# EAGLE design 1-B (EAGLE 9.6.0)
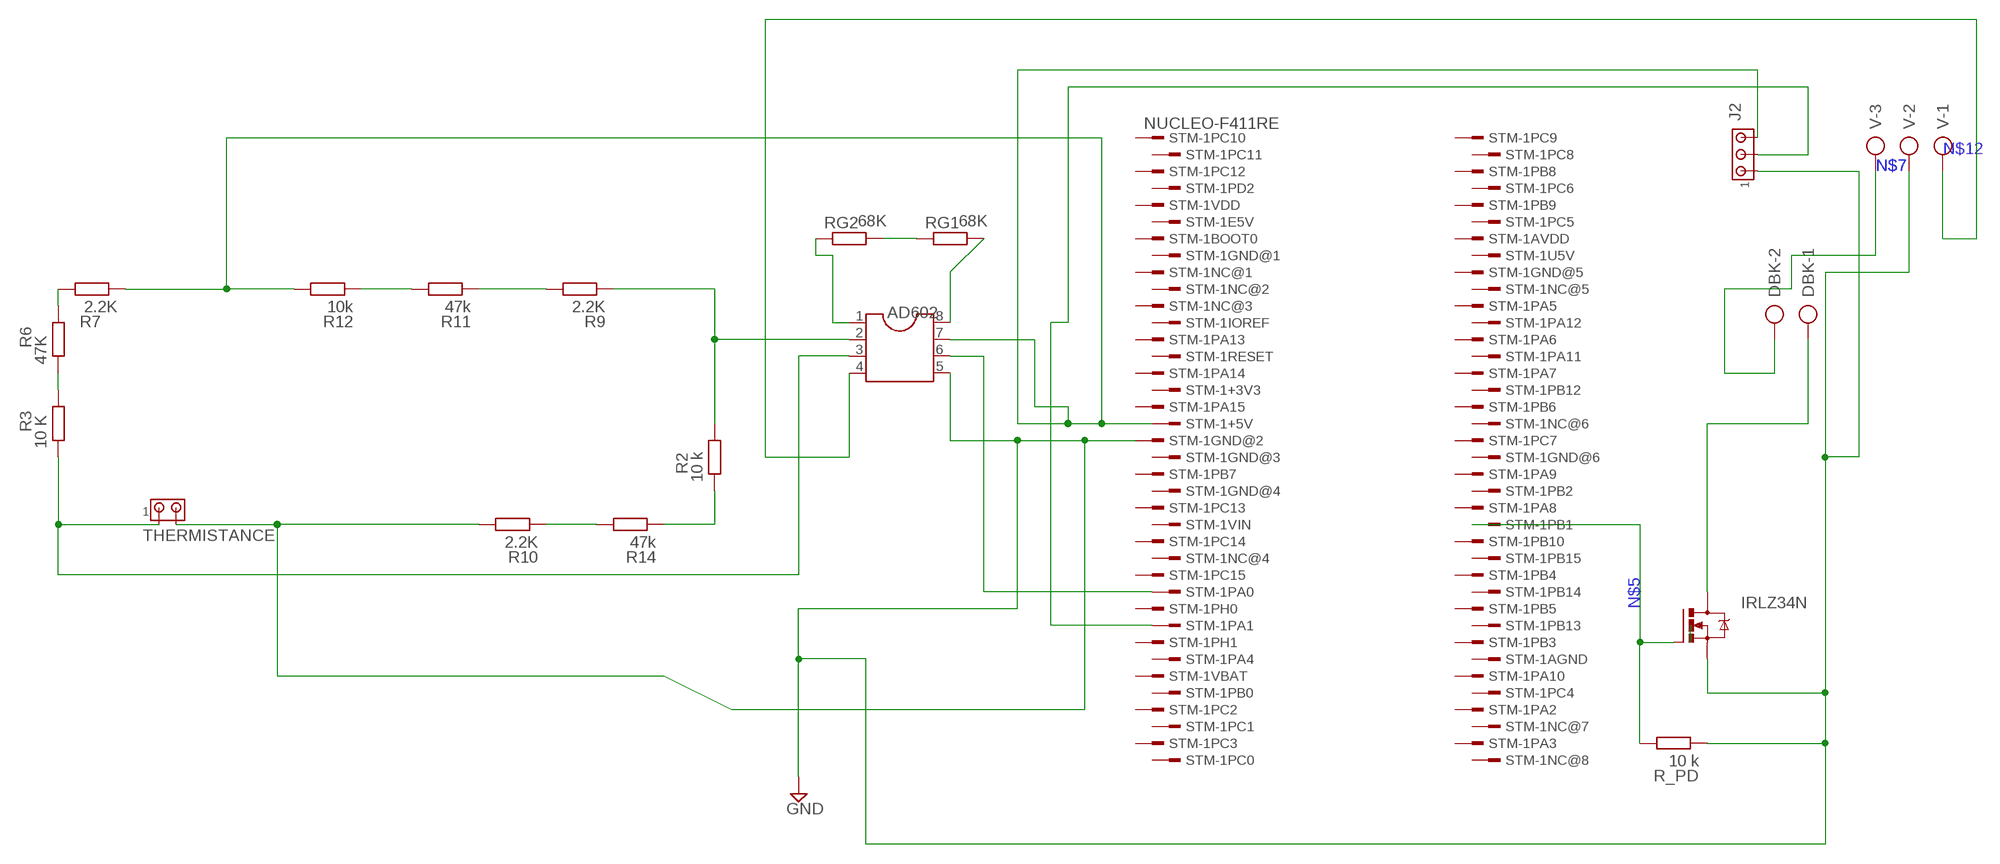
[diagram p0: schematic, sheet 1]

## Parts
AD602  DIL8  [DIL08]
DBK  AK500/2-H  [AK500/2-H]
IRLZ34N  IRLZ44Z  [TO220BH]
J2  MTA03-100  [10X03MTA]
R2  10 k  R-EU_0207/7  [0207/7]
R3  10 K  R-EU_0207/7  [0207/7]
R6  47K  R-EU_0207/7  [0207/7]
R7  2.2K  R-EU_0207/7  [0207/7]
R9  2.2K  R-EU_0207/7  [0207/7]
R10  2.2K  R-EU_0207/7  [0207/7]
R11  47k  R-EU_0207/7  [0207/7]
R12  10k  R-EU_0207/7  [0207/7]
R14  47k  R-EU_0207/7  [0207/7]
R_PD  10 k  R-EU_0207/7  [0207/7]
RG1  68K  R-EU_0207/7  [0207/7]
RG2  68K  R-EU_0207/7  [0207/7]
STM-1  NUCLEO-F411RE  [CONN_STM32_NUCLEO]
THERMISTANCE  MTA02-156  [1X2MTA]
V  AK500/3-H  [AK500/3-H]

## Nets
GND: AD602.5 IRLZ34N.S J2.1 R10.2 R_PD.1 STM-1.19 THERMISTANCE.2 V.2
N$1: R3.2 R6.1
N$2: J2.2 STM-1.30
N$3: AD602.8 RG1.2
N$4: AD602.1 RG2.1
N$5: IRLZ34N.G R_PD.2 STM-1.62
N$6: AD602.7 J2.3 R7.1 R12.2 STM-1.18
N$7: DBK.2 V.3
N$8: DBK.1 IRLZ34N.D
N$9: RG1.1 RG2.2
N$10: AD602.6 STM-1.28
N$11: AD602.3 R3.1 THERMISTANCE.1
N$12: AD602.4 V.1
N$13: R6.2 R7.2
N$16: AD602.2 R2.2 R9.1
N$17: R9.2 R11.1
N$18: R11.2 R12.1
N$19: R2.1 R14.1
N$20: R10.1 R14.2
Unconnected: STM-1.1 STM-1.2 STM-1.3 STM-1.4 STM-1.5 STM-1.6 STM-1.7 STM-1.8 STM-1.9 STM-1.10 STM-1.11 STM-1.12 STM-1.13 STM-1.14 STM-1.15 STM-1.16 STM-1.17 STM-1.20 STM-1.21 STM-1.22 STM-1.23 STM-1.24 STM-1.25 STM-1.26 STM-1.27 STM-1.29 STM-1.31 STM-1.32 STM-1.33 STM-1.34 STM-1.35 STM-1.36 STM-1.37 STM-1.38 STM-1.39 STM-1.40 STM-1.41 STM-1.42 STM-1.43 STM-1.44 STM-1.45 STM-1.46 STM-1.47 STM-1.48 STM-1.49 STM-1.50 STM-1.51 STM-1.52 STM-1.53 STM-1.54 STM-1.55 STM-1.56 STM-1.57 STM-1.58 STM-1.59 STM-1.60 STM-1.61 STM-1.63 STM-1.64 STM-1.65 STM-1.66 STM-1.67 STM-1.68 STM-1.69 STM-1.70 STM-1.71 STM-1.72 STM-1.73 STM-1.74 STM-1.75 STM-1.76

## Library data of the parts
AD602 = ic-package:DIL8: Dual In Line / Socket
DBK = con-ptr500:AK500/2-H: CONNECTOR Aug. 2004 / PTR Meßtechnik: Die Bezeichnung der Serie AK505 wurde geändert. Es handelt sich hierbei um AK500 in horizontaler Ausführung.; OC_FARNELL: unknown; OC_NEWARK: unknown
IRLZ34N = transistor-power:IRLZ44Z: N-Channel HEXFET® Power MOSFET Logic Level AUTOMOTIVE MOSFET Source: http://www.irf.com/product-info/datasheets/data/irlz44zpbf.pdf
J2 = con-amp:MTA03-100: AMP connector
R2 R3 R6 R7 R9-R12 R14 R_PD RG1 RG2 = rcl:R-EU_: RESISTOR, European symbol; SPICEPREFIX: R
STM-1 = nucleo:NUCLEO-F411RE
THERMISTANCE = con-amp:MTA02-156: AMP connector
V = con-ptr500:AK500/3-H: CONNECTOR Aug. 2004 / PTR Meßtechnik: Die Bezeichnung der Serie AK505 wurde geändert. Es handelt sich hierbei um AK500 in horizontaler Ausführung.; OC_FARNELL: unknown; OC_NEWARK: unknown

## Net classes
0 default: width 0.762 mm, clearance 1.016 mm

## Board
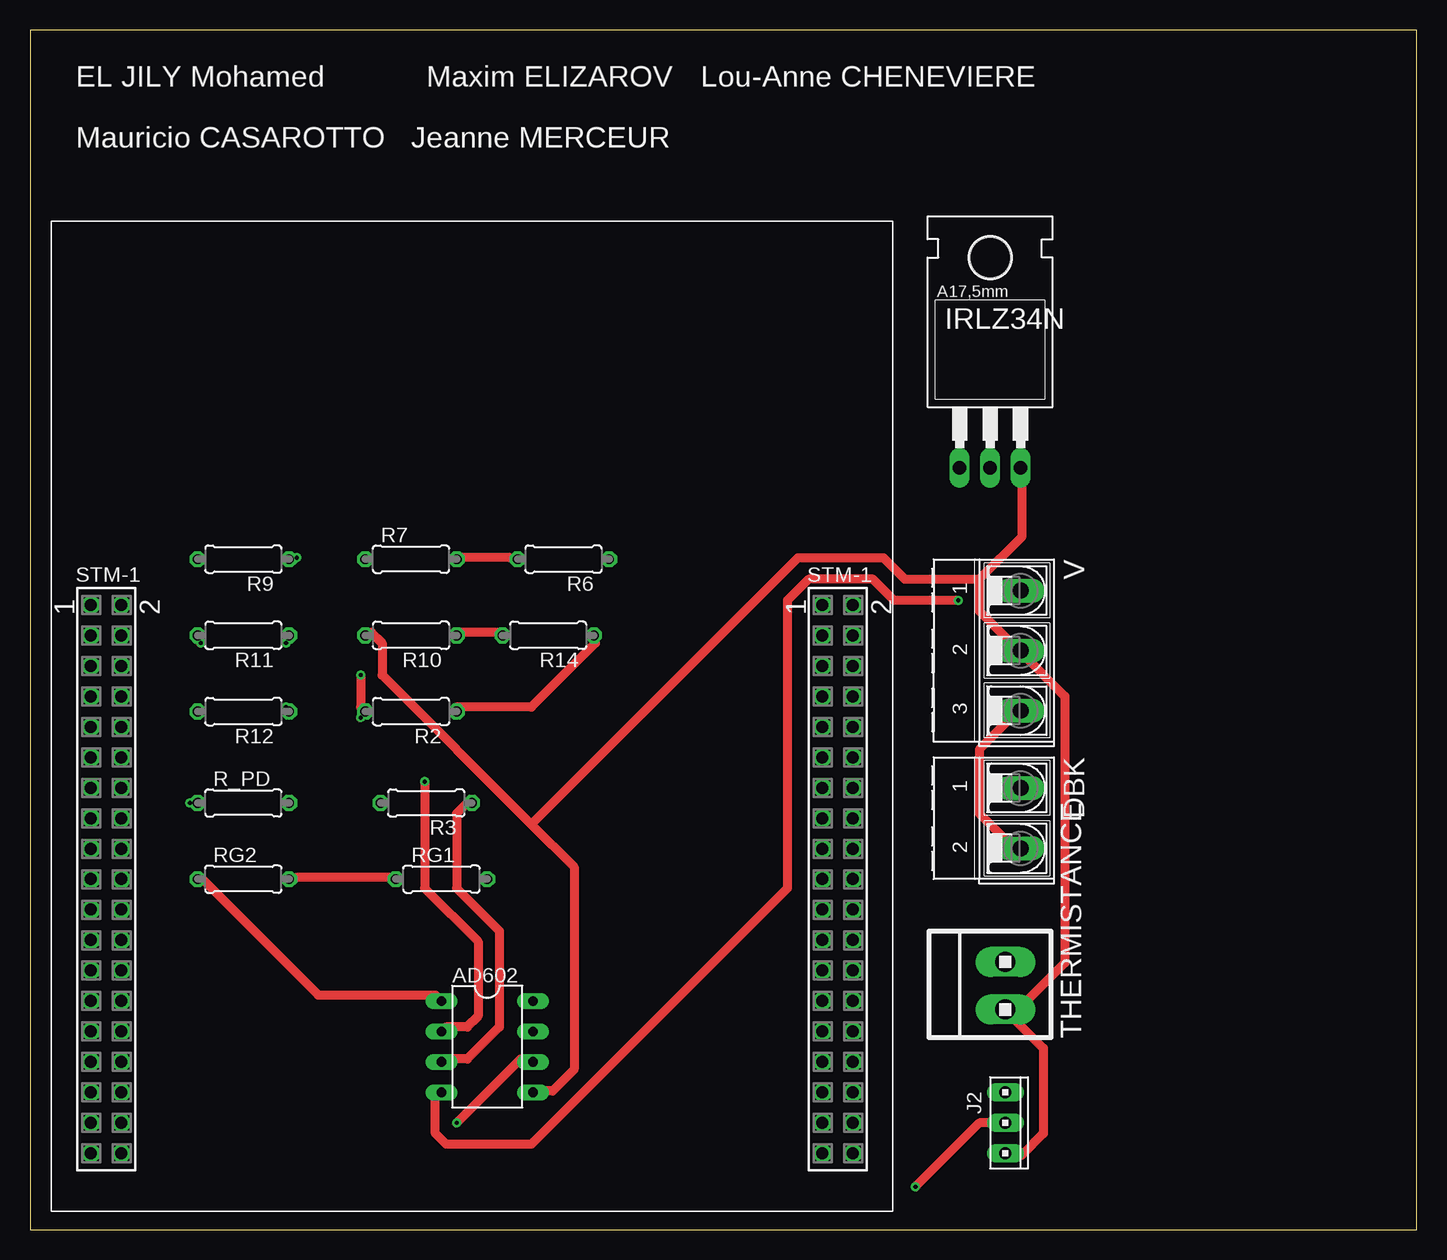
[diagram p1: board, top side]
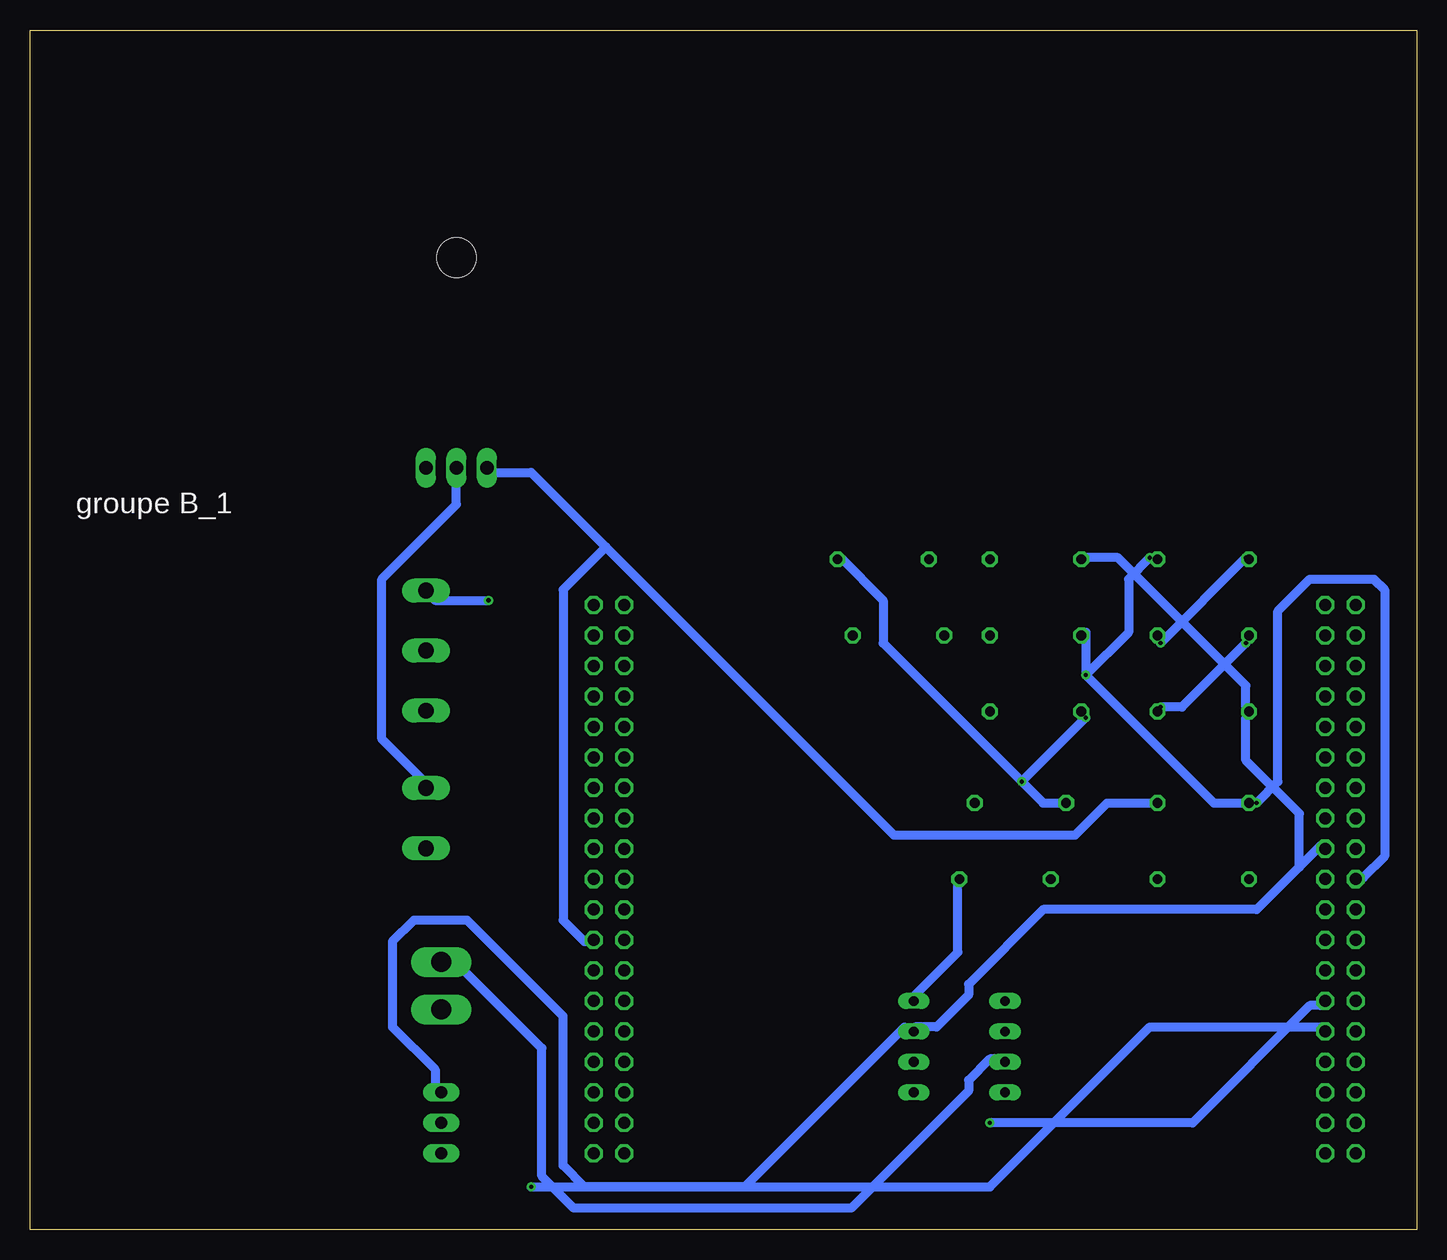
[diagram p2: board, bottom side, seen from below]

Size 115.55 x 100 mm. Coordinates in mm from the lower left corner, seen from the top.
Outline: 0,0 115.55,0 115.55,100 0,100 0,0
Copper layers (1*16): Top 0.035mm / dielectric 1.5mm / Bottom 0.035mm
Design rules "default": minimum track width 6mil, minimum drill 0.35mm, track to track 6mil, track to pad 6mil, pad to pad 6mil, via to via 6mil, smd to smd 6mil, copper to edge 40mil, drill to drill 6mil, minimum pad ring 10mil, minimum via ring 8mil, stop-mask expansion 4mil, vias tented up to drill 0mil, thermal gap 10mil

### Footprints (pad centres in the part's own frame; a part is rotated, then mirrored left to right if it is on the bottom)
DIL08 = drill 0.813 long: 1 -3.81,-3.81; 2 -1.27,-3.81; 3 1.27,-3.81; 4 3.81,-3.81; 5 3.81,3.81; 6 1.27,3.81; 7 -1.27,3.81; 8 -3.81,3.81
AK500/2-H = drill 1.321 long: 1 -2.515,0; 2 2.515,0
TO220BH = drill 1.118 long: D 0,-6.35; G -2.54,-6.35; S 2.54,-6.35 | hole 3.302: 0,11.176
10X03MTA = drill 1.016 long: 1 2.54,0; 2 0,0; 3 -2.54,0
0207/7 = drill 0.813 octagon: 1 -3.81,0; 2 3.81,0
CONN_STM32_NUCLEO = drill 1 pad 1.5 octagon: 1 -1.27,22.86; 2 1.27,22.86; 3 -1.27,20.32; 4 1.27,20.32; 5 -1.27,17.78; 6 1.27,17.78; 7 -1.27,15.24; 8 1.27,15.24; 9 -1.27,12.7; 10 1.27,12.7; 11 -1.27,10.16; 12 1.27,10.16; 13 -1.27,7.62; 14 1.27,7.62; 15 -1.27,5.08; 16 1.27,5.08; 17 -1.27,2.54; 18 1.27,2.54; 19 -1.27,0; 20 1.27,0; 21 -1.27,-2.54; 22 1.27,-2.54; 23 -1.27,-5.08; 24 1.27,-5.08; 25 -1.27,-7.62; 26 1.27,-7.62; 27 -1.27,-10.16; 28 1.27,-10.16; 29 -1.27,-12.7; 30 1.27,-12.7; 31 -1.27,-15.24; 32 1.27,-15.24; 33 -1.27,-17.78; 34 1.27,-17.78; 35 -1.27,-20.32; 36 1.27,-20.32; 37 -1.27,-22.86; 38 1.27,-22.86; 39 59.69,22.86; 40 62.23,22.86; 41 59.69,20.32; 42 62.23,20.32; 43 59.69,17.78; 44 62.23,17.78; 45 59.69,15.24; 46 62.23,15.24; 47 59.69,12.7; 48 62.23,12.7; 49 59.69,10.16; 50 62.23,10.16; 51 59.69,7.62; 52 62.23,7.62; 53 59.69,5.08; 54 62.23,5.08; 55 59.69,2.54; 56 62.23,2.54; 57 59.69,0; 58 62.23,0; 59 59.69,-2.54; 60 62.23,-2.54; 61 59.69,-5.08; 62 62.23,-5.08; 63 59.69,-7.62; 64 62.23,-7.62; 65 59.69,-10.16; 66 62.23,-10.16; 67 59.69,-12.7; 68 62.23,-12.7; 69 59.69,-15.24; 70 62.23,-15.24; 71 59.69,-17.78; 72 62.23,-17.78; 73 59.69,-20.32; 74 62.23,-20.32; 75 59.69,-22.86; 76 62.23,-22.86
1X2MTA = drill 1.676 long: 1 1.981,0; 2 -1.981,0
AK500/3-H = drill 1.321 long: 1 -5.004,0; 2 0,0; 3 5.004,0

### Placement (x,y rotation side)
AD602  38.1,15.24 270 top
DBK  82.55,34.29 270 top
IRLZ34N  80.01,69.85 0 top
J2  81.28,8.89 270 top
R2  31.75,43.18 180 top
R3  33.02,35.56 180 top
R6  44.45,55.88 180 top
R7  31.75,55.88 0 top
R9  17.78,55.88 180 top
R10  31.75,49.53 180 top
R11  17.78,49.53 180 top
R12  17.78,43.18 180 top
R14  43.18,49.53 180 top
R_PD  17.78,35.56 0 top
RG1  34.29,29.21 0 top
RG2  17.78,29.21 0 top
STM-1  6.35,29.21 0 top
THERMISTANCE  81.28,20.32 90 top
V  82.55,48.26 270 top

### Tracks (layer width: path | path; a pad name or v marks a point on that pad's centre or on a via)
GND  (via drill 0.35)
  Top 0.762: J2.1 81.79,6.22 82.68,6.22 84.45,8 84.45,15.11 81.79,17.78 THERMISTANCE.2 81.79,18.67 82.68,18.67 86.23,22.23 86.23,44.45 82.68,48.01 V.2 81.79,48.9 79.12,51.56 79.12,54.23 | 79.12,54.23 82.68,57.78 82.68,63.12 IRLZ34N.S | 41.78,33.78 29.34,46.23 29.34,48.9 28.45,49.78 R10.2 | 41.78,33.78 45.34,30.23 45.34,13.34 43.56,11.56 42.67,11.56 AD602.5 | v13.34,35.56 R_PD.1 | 79.12,54.23 72.9,54.23 71.12,56.01 64.01,56.01 41.78,33.78
  Bottom 0.762: R_PD.1 16.89,35.56 27.56,46.23 27.56,49.78 R10.2 | v13.34,35.56 11.56,37.34 11.56,51.56 8.89,54.23 3.56,54.23 2.67,53.34 2.67,31.11 4.45,29.34 STM-1.19
N$1
  Bottom 0.762: R3.2 31.11,35.56 44.45,48.9 44.45,52.45 48.01,56.01 R6.1
N$2  (via drill 0.35)
  Top 0.762: v73.79,3.56 79.12,8.89 J2.2
  Bottom 0.762: v73.79,3.56 35.56,3.56 22.23,16.89 8,16.89 STM-1.30
N$3
  Bottom 0.762: RG1.2 38.23,29.34 38.23,23.11 41.78,19.56 AD602.8
N$4
  Top 0.762: AD602.1 33.78,19.56 24,19.56 14.22,29.34 RG2.1
N$5
  Bottom 0.762: R_PD.2 25.78,35.56 28.45,32.89 43.56,32.89 67.56,56.9 | 67.56,56.9 73.79,63.12 77.34,63.12 IRLZ34N.G | 67.56,56.9 71.12,53.34 71.12,25.78 69.34,24 68.45,24 STM-1.62
N$6
  Bottom 0.762: 9.78,30.23 8,32 STM-1.18 | 9.78,30.23 13.34,26.67 31.11,26.67 37.34,20.45 37.34,19.56 40.01,16.89 41.78,16.89 AD602.7 42.67,16.89 56.01,3.56 69.34,3.56 71.12,5.33 71.12,17.78 79.12,25.78 83.57,25.78 85.34,24 85.34,16.89 81.79,13.34 81.79,11.56 J2.3 | 9.78,30.23 9.78,34.67 14.22,39.12 14.22,42.67 R12.2 14.22,43.56 14.22,45.34 24.89,56.01 27.56,56.01 R7.1
N$7
  Top 0.762: DBK.2 81.79,32 79.12,34.67 79.12,40.01 81.79,42.67 V.3
N$8
  Bottom 0.762: IRLZ34N.D 80.01,60.45 86.23,54.23 86.23,40.89 82.68,37.34 DBK.1
N$9
  Top 0.762: RG2.2 22.23,29.34 30.23,29.34 RG1.1
N$10  (via drill 0.35)
  Top 0.762: v35.56,8.89 40.89,14.22 41.78,14.22 AD602.6
  Bottom 0.762: v35.56,8.89 18.67,8.89 8.89,18.67 8,18.67 STM-1.28
N$11
  Top 0.762: AD602.3 34.67,14.22 36.45,14.22 39.12,16.89 39.12,24.89 35.56,28.45 35.56,34.67 36.45,35.56 R3.1
  Bottom 0.762: THERMISTANCE.1 80.9,22.23 80.01,22.23 72.9,15.11 72.9,4.45 70.23,1.78 47.12,1.78 37.34,11.56 37.34,12.45 35.56,14.22 34.67,14.22 AD602.3
N$12  (via drill 0.35)
  Top 0.762: v77.34,52.45 72.01,52.45 70.23,54.23 64.9,54.23 63.12,52.45 63.12,28.45 41.78,7.11 34.67,7.11 33.78,8 33.78,11.56 AD602.4
  Bottom 0.762: v77.34,52.45 81.79,52.45 V.1
N$13
  Top 0.762: R7.2 35.56,56.01 40.01,56.01 R6.2
N$16  (via drill 0.35)
  Top 0.762: v27.56,46.23 27.56,43.56 R2.2 v27.56,42.67 | v22.23,56.01 R9.1 | v32.89,37.34 32.89,28.45 37.34,24 37.34,17.78 36.45,16.89 34.67,16.89 AD602.2
  Bottom 0.762: v27.56,46.23 24,49.78 24,54.23 v22.23,56.01 | v27.56,42.67 v32.89,37.34
N$17  (via drill 0.35)
  Top 0.762: v14.22,56.01 R9.2 | v21.34,48.9 R11.1
  Bottom 0.762: v21.34,48.9 v14.22,56.01
N$18  (via drill 0.35)
  Top 0.762: v21.34,43.56 R12.1 | v14.22,48.9 R11.2
  Bottom 0.762: v21.34,43.56 19.56,43.56 v14.22,48.9
N$19
  Top 0.762: R2.1 35.56,43.56 41.78,43.56 47.12,48.9 R14.1
N$20
  Top 0.762: R10.1 35.56,49.78 39.12,49.78 R14.2

### Text on the board
tNames: EL JILY Mohamed | Maxim ELIZAROV | Lou-Anne CHENEVIERE | Mauricio CASAROTTO | Jeanne MERCEUR
bNames: groupe B_1